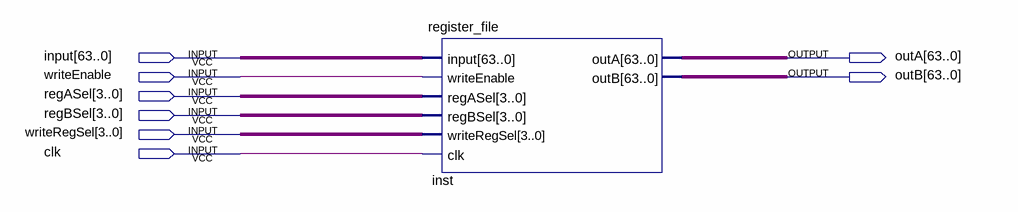
[diagram p0: schematic sheet]
// Quartus schematic lab7ResigterFIle.bdf as structural Verilog: 1 symbols, 8 pins
module lab7ResigterFIle (
  input  [63:0] \input ,
  input  writeEnable,
  input  [3:0] regASel,
  input  [3:0] regBSel,
  input  [3:0] writeRegSel,
  input  clk,
  output [63:0] outA,
  output [63:0] outB
);

  register_file inst (
    .\input (\input ), .writeEnable(writeEnable), .regASel(regASel), .regBSel(regBSel),
    .writeRegSel(writeRegSel), .clk(clk), .outA(outA), .outB(outB));
endmodule
